# EAGLE design radar (EAGLE 7.6.0)
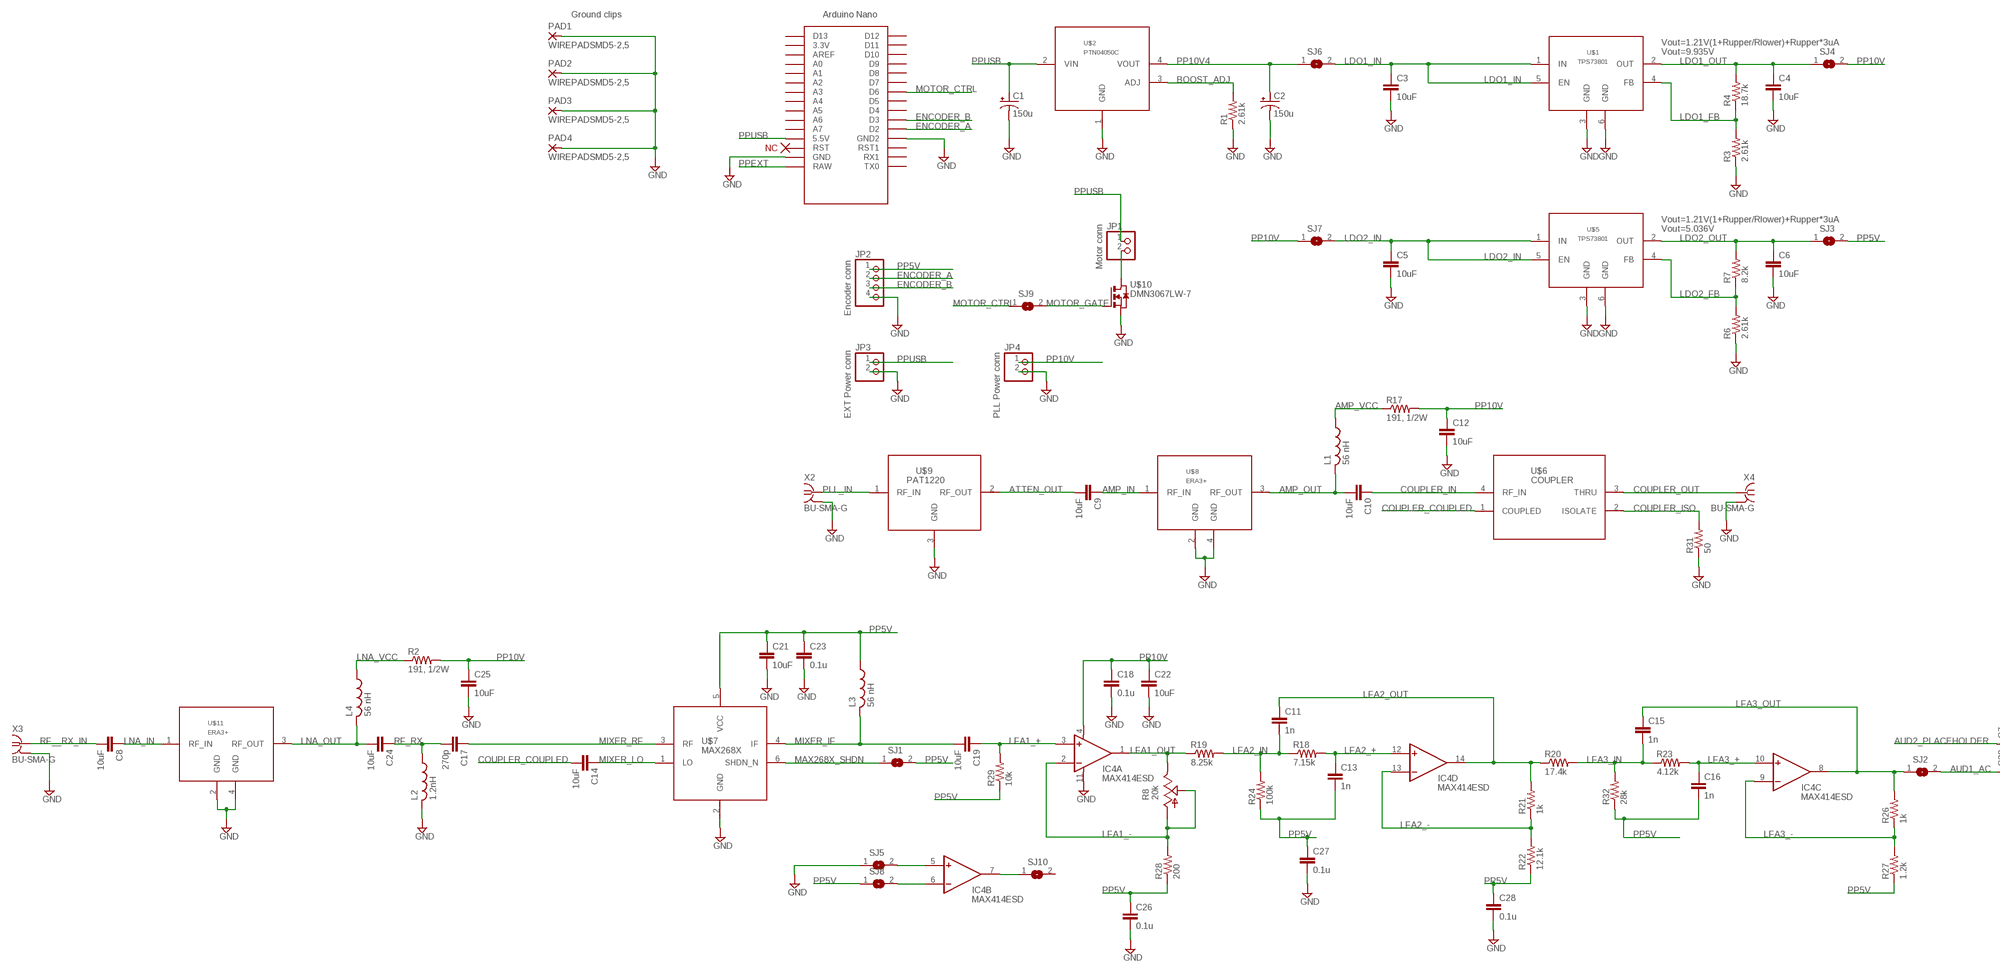
[diagram p0: schematic, sheet 1, part 1 of 2]
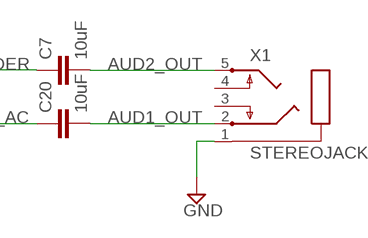
[diagram p1: schematic, sheet 1, part 2 of 2]

## Parts
C1  150u  CPOL-US153CLV-0605  [153CLV-0605]
C2  150u  CPOL-US153CLV-0605  [153CLV-0605]
C3  10uF  C-EUC0805K  [C0805K]
C4  10uF  C-EUC0805K  [C0805K]
C5  10uF  C-EUC0805K  [C0805K]
C6  10uF  C-EUC0805K  [C0805K]
C7  10uF  C-EUC0805K  [C0805K]
C8  10uF  C-EUC0805K  [C0805K]
C9  10uF  C-EUC0805K  [C0805K]
C10  10uF  C-EUC0805K  [C0805K]
C11  1n  C-EUC0603  [C0603]
C12  10uF  C-EUC0805K  [C0805K]
C13  1n  C-EUC0603  [C0603]
C14  10uF  C-EUC0805K  [C0805K]
C15  1n  C-EUC0603  [C0603]
C16  1n  C-EUC0603  [C0603]
C17  270p  C-EUC0603K  [C0603K]
C18  0.1u  C-EUC0603  [C0603]
C19  10uF  C-EUC0805K  [C0805K]
C20  10uF  C-EUC0805K  [C0805K]
C21  10uF  C-EUC0805K  [C0805K]
C22  10uF  C-EUC0805K  [C0805K]
C23  0.1u  C-EUC0603  [C0603]
C24  10uF  C-EUC0805K  [C0805K]
C25  10uF  C-EUC0805K  [C0805K]
C26  0.1u  C-EUC0603  [C0603]
C27  0.1u  C-EUC0603  [C0603]
C28  0.1u  C-EUC0603  [C0603]
IC4  MAX414ESD  [SO14]
JP1  PINHD-1X2  [1X02]
JP2  PINHD-1X4  [1X04]
JP3  PINHD-1X2  [1X02]
JP4  PINHD-1X2  [1X02]
L1  56 nH  L0603  [0603]
L2  1.2nH  L0603  [0603]
L3  56 nH  L0603  [0603]
L4  56 nH  L0603  [0603]
PAD1  WIREPADSMD5-2,5  [5-2,5]
PAD2  WIREPADSMD5-2,5  [5-2,5]
PAD3  WIREPADSMD5-2,5  [5-2,5]
PAD4  WIREPADSMD5-2,5  [5-2,5]
R1  2.61k  R-US_R0603  [R0603]
R2  191, 1/2W  R-US_R1210  [R1210]
R3  2.61k  R-US_R0603  [R0603]
R4  18.7k  R-US_R0603  [R0603]
R6  2.61k  R-US_R0603  [R0603]
R7  8.2k  R-US_R0603  [R0603]
R8  20k  TRIM_US-B25P  [B25P]
R17  191, 1/2W  R-US_R1210  [R1210]
R18  7.15k  R-US_R0603  [R0603]
R19  8.25k  R-US_R0603  [R0603]
R20  17.4k  R-US_R0603  [R0603]
R21  1k  R-US_R0603  [R0603]
R22  12.1k  R-US_R0603  [R0603]
R23  4.12k  R-US_R0603  [R0603]
R24  100k  R-US_R0603  [R0603]
R26  1k  R-US_R0603  [R0603]
R27  1.2k  R-US_R0603  [R0603]
R28  200  R-US_R0603  [R0603]
R29  10k  R-US_R0603  [R0603]
R31  50  R-US_R0603  [R0603]
R32  28k  R-US_R0603  [R0603]
SJ1  SJ  [SJ]
SJ2  SJ  [SJ]
SJ3  SJ  [SJ]
SJ4  SJ  [SJ]
SJ5  SJ  [SJ]
SJ6  SJ  [SJ]
SJ7  SJ  [SJ]
SJ8  SJ  [SJ]
SJ9  SJ  [SJ]
SJ10  SJ  [SJ]
U$1  TPS73801  [SOT223-6]
U$2  PTN04050C  [PTN04050C]
U$3  NANO  [NANO]
U$5  TPS73801  [SOT223-6]
U$6  COUPLER  [COUPLER]
U$7  MAX268X  [SOT23-6]
U$8  ERA3+  [ERA3+]
U$9  PAT1220  [PAT1220]
U$10  DMN3067LW-7  [SOT323]
U$11  ERA3+  [ERA3+]
X1  STEREOJACK  [STX3100]
X2  BU-SMA-G  [BU-SMA-G]
X3  BU-SMA-G  [BU-SMA-G]
X4  BU-SMA-G  [BU-SMA-G]

## Nets
AMP_IN: C9.1 U$8.1(RF_IN)
AMP_OUT: C10.2 L1.2 U$8.3(RF_OUT)
AMP_VCC: L1.1 R17.1
ATTEN_OUT: C9.2 U$9.2(RF_OUT)
AUD1_AC: C20.1 SJ2.2
AUD1_OUT: C20.2 X1.2
AUD2_OUT: C7.2 X1.5
AUD2_PLACEHOLDER: C7.1
BOOST_ADJ: R1.2 U$2.3(ADJ)
COUPLER_COUPLED: C14.2 U$6.1(COUPLED)
COUPLER_IN: C10.1 U$6.4(RF_IN)
COUPLER_ISO: R31.2 U$6.2(ISOLATE)
COUPLER_OUT: U$6.3(THRU) X4.1
ENCODER_A: JP2.2 U$3.D2
ENCODER_B: JP2.3 U$3.D3
GND: C1.- C2.- C3.2 C4.2 C5.2 C6.2 C12.2 C18.2 C21.2 C22.2 C23.2 C25.2 C26.2 C27.2 C28.2 IC4.11(A:V-) JP2.4 JP3.2 JP4.2 L2.2 PAD1.1(P) PAD2.1(P) PAD3.1(P) PAD4.1(P) R1.1 R3.1 R6.1 R31.1 SJ5.1 U$1.3(GND) U$1.6(GND) U$2.1(GND) U$3.GND U$3.GND1(GND2) U$5.3(GND) U$5.6(GND) U$7.2(GND) U$8.2(GND) U$8.4(GND) U$9.3(GND) U$10.2(S) U$11.2(GND) U$11.4(GND) X1.1 X2.2 X2.3 X2.4 X2.5 X3.2 X3.3 X3.4 X3.5 X4.2 X4.3 X4.4 X4.5
LDO1_FB: R3.2 R4.1 U$1.4(FB)
LDO1_IN: C3.1 SJ6.2 U$1.1(IN) U$1.5(EN)
LDO1_OUT: C4.1 R4.2 SJ4.1 U$1.2(OUT)
LDO2_FB: R6.2 R7.1 U$5.4(FB)
LDO2_IN: C5.1 SJ7.2 U$5.1(IN) U$5.5(EN)
LDO2_OUT: C6.1 R7.2 SJ3.1 U$5.2(OUT)
LFA1_+: C19.1 IC4.3(A:+IN) R29.2
LFA1_-: IC4.2(A:-IN) R8.A R8.S R28.2
LFA1_OUT: IC4.1(A:OUT) R8.E R19.1
LFA2_+: C13.1 IC4.12(D:+IN) R18.2
LFA2_-: IC4.13(D:-IN) R21.1 R22.2
LFA2_IN: C11.2 R18.1 R19.2 R24.2
LFA2_OUT: C11.1 IC4.14(D:OUT) R20.1 R21.2
LFA3_+: C16.1 IC4.10(C:+IN) R23.2
LFA3_-: IC4.9(C:-IN) R26.1 R27.2
LFA3_IN: C15.2 R20.2 R23.1 R32.2
LFA3_OUT: C15.1 IC4.8(C:OUT) R26.2 SJ2.1
LNA_IN: C8.1 U$11.1(RF_IN)
LNA_OUT: C24.2 L4.2 U$11.3(RF_OUT)
LNA_VCC: L4.1 R2.1
MAX268X_SHDN: SJ1.1 U$7.6(SHDN_N)
MIXER_IF: C19.2 L3.2 U$7.4(IF)
MIXER_LO: C14.1 U$7.1(LO)
MIXER_RF: C17.1 U$7.3(RF)
MOTOR_CTRL: SJ9.1 U$3.D6
MOTOR_GATE: SJ9.2 U$10.1(G)
N$1: JP1.2 U$10.3(D)
N$2: IC4.7(B:OUT) SJ10.1
N$4: IC4.5(B:+IN) SJ5.2
N$5: IC4.6(B:-IN) SJ8.2
PLL_IN: U$9.1(RF_IN) X2.1
PP5V: C13.2 C16.2 C21.1 C23.1 C26.1 C27.1 C28.1 JP2.1 L3.1 R22.1 R24.1 R27.1 R28.1 R29.1 R32.1 SJ1.2 SJ3.2 SJ8.1 U$7.5(VCC)
PP10V: C12.1 C18.1 C22.1 C25.1 IC4.4(A:V+) JP4.1 R2.2 R17.2 SJ4.2 SJ7.1
PP10V4: C2.+ SJ6.1 U$2.4(VOUT)
PPEXT: U$3.RAW
PPUSB: C1.+ JP1.1 JP3.1 U$2.2(VIN) U$3.5V(5.5V)
RF__RX_IN: C8.2 X3.1
RF_RX: C17.2 C24.1 L2.1
Unconnected: SJ10.2 U$3.3.3V U$3.A0 U$3.A1 U$3.A2 U$3.A3 U$3.A4 U$3.A5 U$3.A6 U$3.A7 U$3.AREF U$3.D4 U$3.D5 U$3.D7 U$3.D8 U$3.D9 U$3.D10 U$3.D11 U$3.D12 U$3.D13 U$3.ICSP1 U$3.ICSP2 U$3.ICSP3 U$3.ICSP4 U$3.ICSP5 U$3.ICSP6 U$3.RST U$3.RST1 U$3.RX1 U$3.TX0 X1.3 X1.4

## Notes on the sheet
- Ground clips
- Vout=1.21V(1+Rupper/Rlower)+Rupper*3uA
- Vout=9.935V
- Vout=1.21V(1+Rupper/Rlower)+Rupper*3uA
- Vout=5.036V
- Motor conn
- Encoder conn
- EXT Power conn | PLL Power conn

## Library data of the parts
C1 C2 = rcl:CPOL-US: POLARIZED CAPACITOR, American symbol; DIGI: PCE4443CT-ND
C3-C10 C12 C14 C19-C22 C24 C25 = rcl:C-EU: CAPACITOR, European symbol; DIGI: 587-2985-1-ND
C11 C13 C15 C16 = rcl:C-EU: CAPACITOR, European symbol; DIGI: 311-1085-1-ND
C17 = rcl:C-EU: CAPACITOR, European symbol; DIGI: 399-9054-1-ND
C18 C23 C26-C28 = rcl:C-EU: CAPACITOR, European symbol; DIGI: 311-1088-1-ND
IC4 = radar:MAX414ESD: OP AMP; DIGI: MAX414ESD+-ND
JP1 JP3 JP4 = pinhead:PINHD-1X2: PIN HEADER
JP2 = pinhead:PINHD-1X4: PIN HEADER
L1 L3 L4 = radar:L0603; DIGI: 712-1443-1-ND
L2 = radar:L0603; DIGI: 535-11530-1-ND
PAD1-PAD4 = wirepad:WIREPAD: Wire PAD connect wire on PCB
R1 R3 R6 = rcl:R-US_: RESISTOR, American symbol; DIGI: 311-2520-1-ND
R2 R17 = rcl:R-US_: RESISTOR, American symbol; DIGI: P191AACT-ND
R4 = rcl:R-US_: RESISTOR, American symbol; DIGI: 311-18.7KHRCT-ND
R7 = rcl:R-US_: RESISTOR, American symbol; DIGI: 311-2680-1-ND
R8 = pot:TRIM_US-: POTENTIOMETER; DIGI: 3362P-203LF-ND
R18 = rcl:R-US_: RESISTOR, American symbol; DIGI: 311-7.15KHRCT-ND
R19 = rcl:R-US_: RESISTOR, American symbol; DIGI: RNCP0805FTD8K25CT-ND
R20 = rcl:R-US_: RESISTOR, American symbol; DIGI: 311-17.4KHRCT-ND
R21 R26 = rcl:R-US_: RESISTOR, American symbol; DIGI: 311-1.00KHRCT-ND
R22 = rcl:R-US_: RESISTOR, American symbol; DIGI: 541-12.1KSCT-ND
R23 = rcl:R-US_: RESISTOR, American symbol; DIGI: 311-4.12KHRCT-ND
R24 = rcl:R-US_: RESISTOR, American symbol; DIGI: 541-3247-1-ND
R27 = rcl:R-US_: RESISTOR, American symbol; DIGI: 311-1.20KHRCT-ND
R28 = rcl:R-US_: RESISTOR, American symbol; DIGI: RNCP0805FTD200RCT-ND
R29 = rcl:R-US_: RESISTOR, American symbol; DIGI: 311-10.0KHRCT-ND
R31 = rcl:R-US_: RESISTOR, American symbol; DIGI: RNCP0805FTD49R9CT-ND
R32 = rcl:R-US_: RESISTOR, American symbol; DIGI: 311-28.0KHRCT-ND
SJ1-SJ10 = jumper:SJ: SMD solder JUMPER
U$1 U$5 = radar:TPS73801; DIGI: 296-39489-1-ND
U$2 = radar:PTN04050C; DIGI: 296-20498-ND
U$3 = Arduino-clone:NANO: Arduino Nano
U$6 = radar:COUPLER: HHM2917B1; DIGI: 445-172645-1-ND
U$7 = radar:MAX268X; DIGI: MAX2682EUT+TCT-ND
U$8 U$11 = radar:ERA3+
U$9 = radar:PAT1220; DIGI: PAT123CT-ND
U$10 = radar:DMN3067LW-7; DIGI: DMN3067LW-7DICT-ND
X1 = adafruit:STEREOJACK: MIC/HEADPHONE JACK Stereo jack with two switches. Kycon STX3100, CUI SJ1-3555NG and/or 4UCon 05544; DIGI: CP1-3555NG-ND
X2-X4 = radar:BU-SMA-G: FEMALE SMA CONNECTOR Radiall distributor RS 193-9117; DIGI: ACX2074-ND; OC_FARNELL: unknown; OC_NEWARK: unknown

## Board
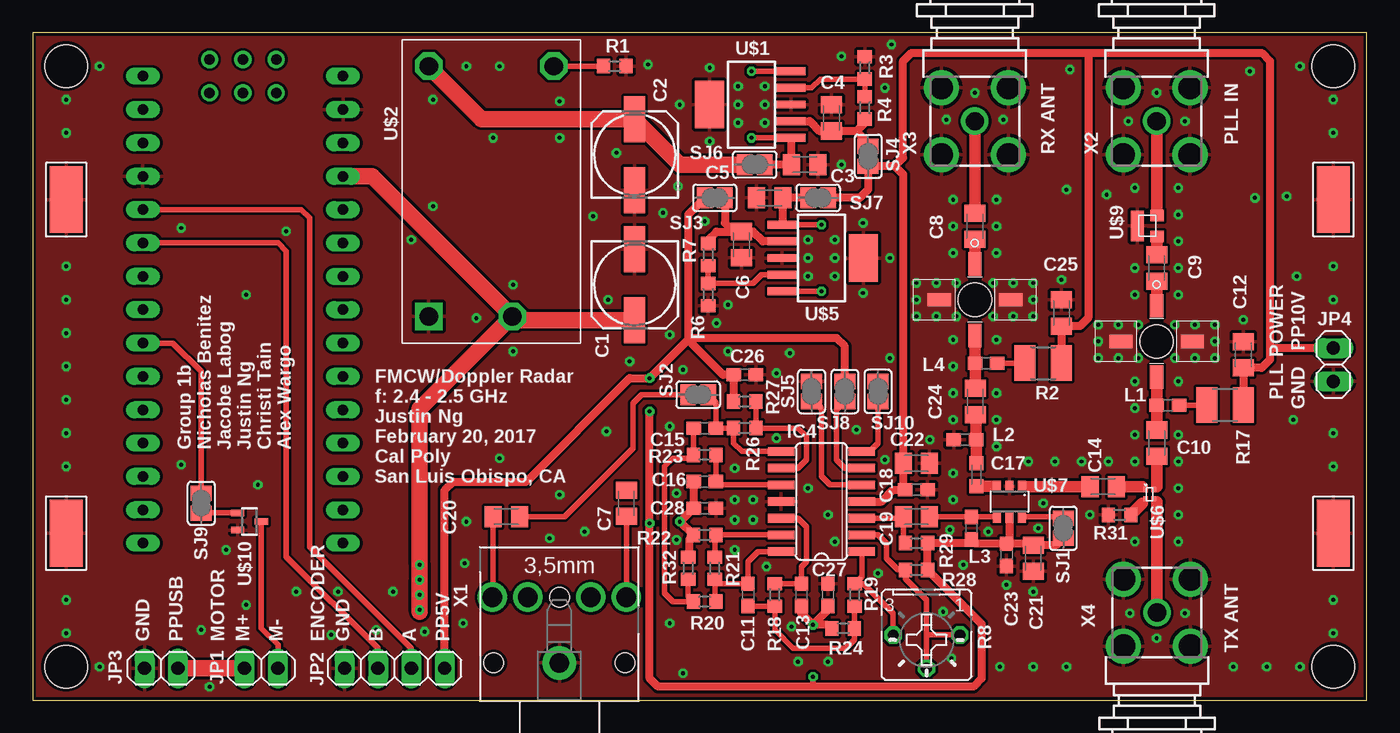
[diagram p2: board, top side]
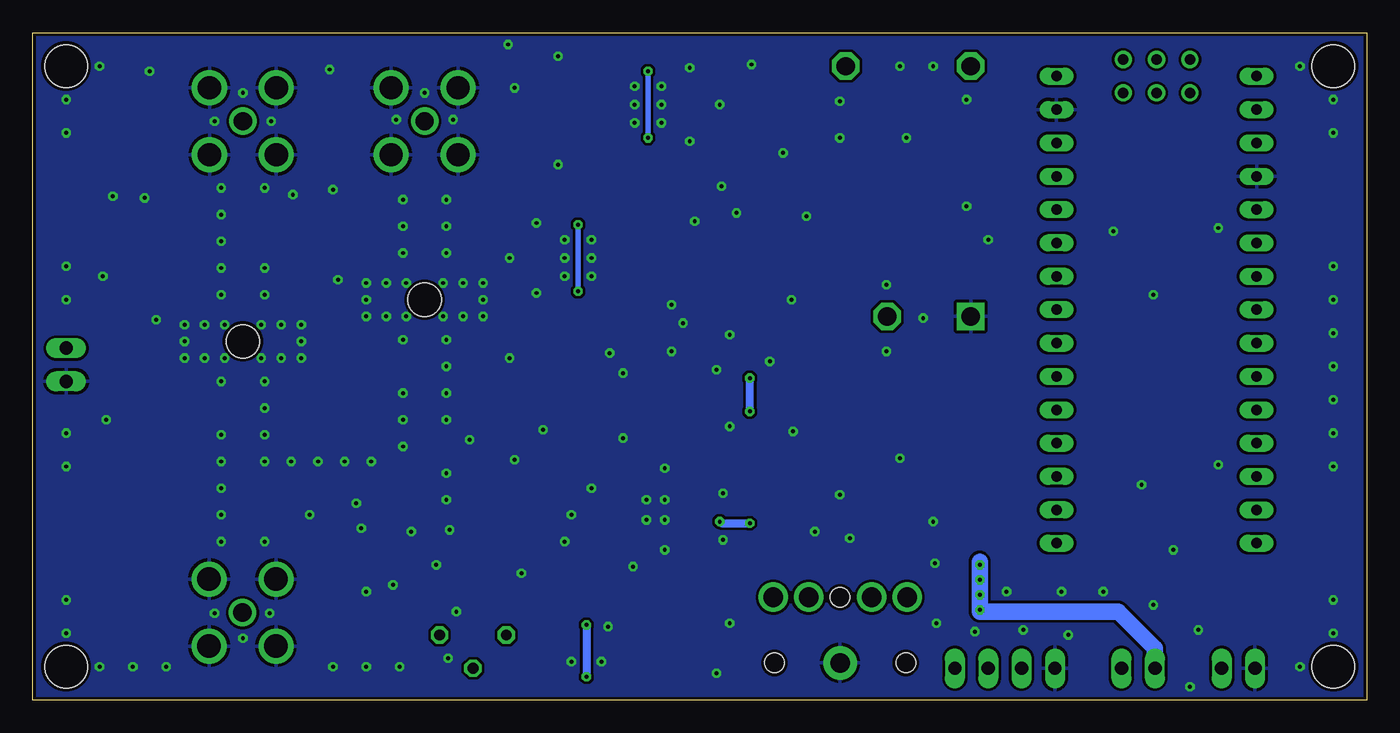
[diagram p3: board, bottom side, seen from below]

Size 101.6 x 50.8 mm. Coordinates in mm from the lower left corner, seen from the top.
Outline: 0,50.8 0,0 101.6,0 101.6,50.8 0,50.8
Copper layers (1*16): Top 0.035mm / dielectric 1.5mm / Bottom 0.035mm
Design rules "default *": minimum track width 8mil, minimum drill 10mil, track to track 8mil, track to pad 8mil, pad to pad 8mil, via to via 8mil, smd to smd 8mil, copper to edge 10mil, drill to drill 8mil, minimum pad ring 10mil, minimum via ring 8mil, stop-mask expansion 4mil, vias tented up to drill 0mil, thermal gap 10mil
Holes 3.26 mm at 2.54,48.26 2.54,2.54 99.06,48.26 99.06,2.54

### Footprints (pad centres in the part's own frame; a part is rotated, then mirrored left to right if it is on the bottom)
153CLV-0605 = smd 3.5 x 1.6: + 2.7,0; - -2.7,0
C0805K = smd 1.3 x 1.6: 1 -1,0; 2 1,0
C0603 = smd 1.1 x 1: 1 -0.85,0; 2 0.85,0
C0603K = smd 1.05 x 1.08: 1 -0.875,0; 2 0.875,0
SO14 = smd 0.66 x 2.032: 1 -3.81,-3.073; 2 -2.54,-3.073; 3 -1.27,-3.073; 4 0,-3.073; 5 1.27,-3.073; 6 2.54,-3.073; 7 3.81,-3.073; 8 3.81,3.073; 9 2.54,3.073; 10 1.27,3.073; 11 0,3.073; 12 -1.27,3.073; 13 -2.54,3.073; 14 -3.81,3.073
1X02 = drill 1.016 long: 1 -1.27,0; 2 1.27,0
1X04 = drill 1.016 long: 1 -3.81,0; 2 -1.27,0; 3 1.27,0; 4 3.81,0
0603 = smd 1.1 x 1: 1 -0.85,0; 2 0.85,0
5-2,5 = smd 2.54 x 5.08: 1 0,0
R0603 = smd 1 x 1.1: 1 -0.85,0; 2 0.85,0
R1210 = smd 1.6 x 2.7: 1 -1.4,0; 2 1.4,0
B25P = drill 0.813 octagon: A -2.54,0; E 2.54,0; S 0,2.54
SJ = smd 1.168 x 1.6: 1 -0.762,0; 2 0.762,0
SOT223-6 = smd 0.6 x 2.2: 1 -2.54,-3; 2 -1.27,-3; 3 0,-3; 4 1.27,-3; 5 2.54,-3 | smd 3.6 x 2.2: 6 0,3.2
PTN04050C = drill 1.397 square: 1 -9.525,4.763 | drill 1.397 octagon: 2 -9.525,-1.587; 3 9.525,-4.763; 4 9.525,4.763
NANO = drill 0.8 long: 3.3V -10.16,24.13; 5V -10.16,-1.27; A0 -10.16,19.05; A1 -10.16,16.51; A2 -10.16,13.97; A3 -10.16,11.43; A4 -10.16,8.89; A5 -10.16,6.35; A6 -10.16,3.81; A7 -10.16,1.27; AREF -10.16,21.59; D2 5.08,1.27; D3 5.08,3.81; D4 5.08,6.35; D5 5.08,8.89; D6 5.08,11.43; D7 5.08,13.97; D8 5.08,16.51; D9 5.08,19.05; D10 5.08,21.59; D11 5.08,24.13; D12 5.08,26.67; D13 -10.16,26.67; GND -10.16,-6.35; GND1 5.08,-1.27; RAW -10.16,-8.89; RST -10.16,-3.81; RST1 5.08,-3.81; RX1 5.08,-6.35; TX0 5.08,-8.89 | drill 0.8: ICSP1 -5.08,-10.16; ICSP2 -5.08,-7.62; ICSP3 -2.54,-10.16; ICSP4 -2.54,-7.62; ICSP5 0,-10.16; ICSP6 0,-7.62
COUPLER = smd 0.4 x 0.35: 1 -0.35,-0.3; 2 0.35,-0.3; 3 0.35,0.3; 4 -0.35,0.3
SOT23-6 = smd 0.6 x 0.9: 1 -0.95,-1.15; 2 0,-1.15; 3 0.95,-1.15; 4 0.95,1.15; 5 0,1.15; 6 -0.95,1.15
ERA3+ = smd 1.016 x 1.778: 1 0,-2.718; 3 0,2.718 | smd 1.778 x 1.016: 2 2.718,0; 4 -2.718,0 | hole 2.54: 0,0
PAT1220 = smd 0.9 x 1: 1 -0.8,1; 2 0.8,1 | smd 2.3 x 1: 3 0,-0.49
SOT323 = smd 0.5 x 1: 1 -0.65,-0.9; 2 0.65,-0.9; 3 0,0.9
STX3100 = drill 1.5 pad 2.54: 1 2.7,-0.1 | drill 1.5: 2 7.7,5; 3 7.7,2.3; 4 7.7,-2.5; 5 7.7,-5.2 | hole 1.5: 2.7,4.9; 2.7,-5.1; 7.7,-0.1
BU-SMA-G = drill 1.397: 1 0,0 | drill 1.778: 2 -2.55,2.55; 3 2.55,2.55; 4 2.55,-2.55; 5 -2.55,-2.55

### Placement (x,y rotation side)
C1  45.85,31.62 270 top
C2  45.85,41.53 90 top
C3  58.8,40.77 0 top
C4  60.83,44.32 90 top
C5  56.13,38.23 180 top
C6  53.98,34.67 270 top
C7  45.21,14.99 270 top
C8  71.75,36.07 90 top
C9  85.6,32.89 90 top
C10  85.62,19.56 90 top
C11  54.48,8 270 top
C12  92.2,26.29 90 top
C13  58.55,8 270 top
C14  81.53,16.26 0 top
C15  51.18,20.7 180 top
C16  51.18,16.64 180 top
C17  71.88,17.14 90 top
C18  67.31,16 0 top
C19  67.31,13.97 0 top
C20  36.07,13.97 180 top
C21  76.2,10.79 270 top
C22  67.31,18.03 0 top
C23  74.17,11.05 270 top
C24  71.78,22.73 90 top
C25  78.36,29.46 90 top
C26  54.23,24.77 0 top
C27  60.58,8 90 top
C28  51.18,14.61 0 top
IC4  60.07,15.11 90 top
JP1  17.4,2.41 0 top
JP2  27.56,2.41 180 top
JP3  9.78,2.41 180 top
JP4  99.06,25.53 270 top
L1  86.46,22.45 180 top
L2  70.99,19.81 180 top
L3  71.5,13.08 90 top
L4  72.62,25.65 180 top
PAD1  99.06,12.7 0 top
PAD2  99.06,38.1 0 top
PAD3  2.54,12.7 0 top
PAD4  2.54,38.1 0 top
R1  44.32,48.26 180 top
R2  76.96,25.65 0 top
R3  63.37,48.13 270 top
R4  63.37,45.09 270 top
R6  51.44,30.86 90 top
R7  51.44,33.91 90 top
R8  68.07,4.95 180 top
R17  90.81,22.48 0 top
R18  56.52,8 90 top
R19  62.61,8 270 top
R20  51.18,7.49 180 top
R21  51.94,10.03 270 top
R22  51.18,12.57 0 top
R23  51.18,18.67 0 top
R24  61.72,5.46 0 top
R26  54.23,20.7 180 top
R27  54.23,22.73 0 top
R28  67.31,9.91 180 top
R29  67.31,11.94 180 top
R31  82.78,14.1 0 top
R32  49.91,10.03 270 top
SJ1  78.49,13.08 270 top
SJ2  50.67,23.24 180 top
SJ3  51.94,38.23 180 top
SJ4  63.63,41.4 270 top
SJ5  59.31,23.5 270 top
SJ6  54.99,40.77 0 top
SJ7  59.82,38.23 180 top
SJ8  61.85,23.5 270 top
SJ9  12.83,14.99 270 top
SJ10  64.39,23.5 90 top
U$1  54.74,45.34 90 top
U$2  34.92,38.73 90 top
U$3  13.46,38.61 180 top
U$5  60.07,33.66 270 top
U$6  85.06,15.67 270 top
U$7  74.4,15.11 180 top
U$8  85.6,27.3 180 top
U$9  84.63,36.09 270 top
U$10  16.51,13.59 270 top
U$11  71.75,30.48 180 top
X1  40.01,0.13 90 top
X2  85.6,44.07 90 top
X3  71.75,44.07 90 top
X4  85.62,6.65 270 top

### Tracks (layer width: path | path; a pad name or v marks a point on that pad's centre or on a via)
AMP_IN
  Top 0.872: C9.1 U$8.1
AMP_OUT
  Top 0.872: U$8.3 85.61,24.57 L1.2 85.62,22.44 C10.2
AMP_VCC
  Top 0.406: R17.1 89.38,22.45 L1.1
ATTEN_OUT
  Top 0.406: 85.6,35.31 85.56,35.34 | U$9.2 85.6,35.26 85.6,35.18
  Top 0.872: C9.2 85.6,35.18 85.6,35.31
AUD1_AC
  Top 0.406: SJ2.2 46.35,23.24 45.72,22.61 45.72,19.18 40.51,13.97 C20.1
AUD1_OUT
  Top 0.406: X1.2 35.07,7.89 C20.2
AUD2_OUT
  Top 0.406: C7.2 45.2,13.98 X1.5
BOOST_ADJ
  Top 0.406: 39.66,48.28 U$2.3 R1.2
COUPLER_COUPLED
  Top 0.305: 84.51,16.26 84.74,16.02 U$6.1
  Top 0.872: C14.2 84.51,16.26
COUPLER_IN
  Top 0.305: 85.62,16.26 85.39,16.02 U$6.4
  Top 0.872: C10.1 85.62,16.26
COUPLER_ISO
  Top 0.305: U$6.2 84.46,15.02 84.46,14.98 84.49,14.96
  Top 0.872: R31.2 84.49,14.96 84.51,14.98
COUPLER_OUT
  Top 0.305: 85.62,15.09 85.6,15.09 U$6.3
  Top 0.872: X4.1 85.62,15.09
ENCODER_A
  Top 0.406: U$3.D2 20.45,37.34 21.08,36.7 21.08,11.68 28.83,3.94 JP2.2
ENCODER_B
  Top 0.406: U$3.D3 18.67,34.8 19.3,34.16 19.3,10.92 26.29,3.94 JP2.3
GND  (via drill 0.3)
  other vias: 72.77,12.83 76.58,13.08 2.54,45.72 2.54,43.18 2.54,33.02 2.54,30.48 2.54,27.94 2.54,25.4 2.54,22.86 2.54,20.32 2.54,17.78 2.54,7.62 2.54,5.08 5.08,2.54 99.06,45.72 99.06,43.18 99.06,33.02 99.06,30.48 99.06,20.32 99.06,17.78 99.06,7.62 99.06,5.08 96.52,2.54 93.98,2.54 91.44,2.54 78.74,2.54 76.2,2.54 73.66,2.54 96.52,48.26 5.08,48.26 33.02,48.26 35.56,48.26 67.31,30.48 76.2,30.48 67.31,31.75 68.83,31.75 67.31,29.21 70.36,31.75 70.36,29.21 68.83,29.21 73.15,31.75 73.15,29.21 76.2,31.75 76.2,29.21 74.68,29.21 74.68,31.75 84.2,28.57 84.2,26.04 87,28.57 87,26.04 81.15,28.57 82.68,28.57 81.15,26.04 81.15,27.3 82.68,26.04 90.04,28.57 90.04,26.04 90.04,27.3 88.52,26.04 88.52,28.57 73.41,36.07 70.1,36.07 70.1,34.04 73.41,34.04 70.1,38.1 73.41,38.1 83.95,32.89 87.25,32.89 83.95,30.86 87.25,30.86 87.25,34.92 87.25,36.96 87.25,38.99 83.95,38.99 70.1,27.43 73.41,27.43 87.25,24.26 83.95,24.26 70.1,25.4 83.95,22.23 70.1,23.37 70.1,21.34 83.95,20.19 83.95,18.16 87.25,20.19 87.25,18.16 73.41,23.37 73.41,21.34 73.41,19.3 87.25,16.13 87.25,14.1 87.25,12.06 83.95,12.06 70.1,17.27 70.1,15.24 81.92,18.16 79.88,18.16 77.85,18.16 75.82,18.16 69.6,44.2 73.91,44.2 83.44,44.07 87.76,44.07 71.75,46.23 85.6,46.23 74.17,8.76 76.2,8.26 80.52,14.1 92.2,28.96 78.36,32 68.33,19.81 61.59,40.77 49.15,39.12 51.56,42.55 51.56,48.13 49.28,45.34 65.28,33.66 63.25,36.32 63.25,30.99 55.75,45.34 53.72,45.34 53.72,46.74 55.75,46.74 53.72,43.94 55.75,43.94 59.05,33.66 61.09,33.66 61.09,35.05 61.09,32.26 59.05,32.26 59.05,35.05 51.18,36.45 52.96,30.1 61.59,49.02 56.64,24.89 53.47,15.24 54.86,15.24 53.47,13.72 54.86,13.72 53.47,11.43 53.47,17.65 59.05,16.13 60.58,14.1 61.09,12.06 55.88,10.16 64.39,9.65 57.78,5.59 58.29,2.92 60.58,2.92 69.98,3.17 69.34,6.73 69.85,12.95 76.96,14.99 70.87,10.29 57.66,26.42 52.96,26.54 62.74,20.57 65.28,26.04 49.53,25.15 48.51,20.83 43.69,20.45 40.13,15.62 42.04,12.83 33.02,13.59 39.37,12.32 32.89,10.41 32.77,5.84 48.51,5.84 49.53,2.03 49.02,15.75 49.02,12.19 45.47,25.78 52.07,28.7 48.51,27.81 33.78,29.08 36.58,31.62 36.58,26.54 30.48,45.72 40.13,45.59 40.13,42.8 46.86,48.39 64.9,46.61 44.45,41.66 48.01,37.08 42.67,36.83 35.56,18.41 27.43,8.26 23.24,8.26 26.16,5.33 29.84,5.21 22.73,4.95 20.07,8.26 16.26,7.24 13.46,1.02 12.83,5.33 17.14,16.38 14.73,11.43 11.3,17.91 11.3,35.94 19.3,35.69 16.26,30.86 30.48,37.59 28.83,35.05 35.05,42.8 43.81,30.48 65.41,49.91 78.99,48.01 92.71,47.88 93.09,38.23 78.74,38.86 95.5,38.35 81.79,38.48 96.01,21.34 96.27,32.26 85.6,4.7 83.57,6.6 87.76,6.6 64.9,18.29 56.64,19.94
  pour Top (rank 6): 101.6,50.8 0,50.8 0,0 101.6,0
  pour Bottom (rank 6): 101.6,0 0,0 0,50.8 101.6,50.8
  pour Top (no thermals): 67.06,32 67.06,28.96 76.45,28.96 76.45,32
  pour Top (no thermals): 80.9,28.83 80.9,25.78 90.3,25.78 90.3,28.83
LDO1_FB
  Top 0.406: R4.1 R3.2 59.98,47.28 59.31,46.61 U$1.4
LDO1_IN  (via drill 0.3)
  Top 0.406: U$1.5 v54.74,47.88 | v54.74,42.8 U$1.1 | 57.74,40.83 C3.1
  Top 0.61: U$1.1 57.74,40.83 | C3.1 SJ6.2
  Bottom 0.406: v54.74,47.88 v54.74,42.8
LDO1_OUT
  Top 0.406: R4.2 63.37,43.96 | 60.98,43.31 60.83,43.31 C4.1 | 63.63,42.43 SJ4.1
  Top 0.61: U$1.2 59.18,44.07 59.93,43.32 C4.1 62.74,43.32 | 63.37,43.96 62.74,43.32 | 62.74,43.32 63.63,42.43
LDO2_FB
  Top 0.406: U$5.4 55.5,32.38 54.86,31.75 51.44,31.75 | 51.44,31.75 R6.2 | 51.44,33.02 R7.1 51.44,31.75
LDO2_IN  (via drill 0.3)
  Top 0.406: v60.07,36.2 U$5.1 57.13,36.26 | v60.07,31.11 U$5.5
  Top 0.61: 57.13,36.26 C5.1 SJ7.2
  Bottom 0.406: v60.07,36.2 v60.07,31.11
LDO2_OUT
  Top 0.406: 54.86,35.67 C6.1 | R7.2 51.44,35.04
  Top 0.61: U$5.2 55.61,34.92 54.86,35.67 | 51.44,35.04 52.07,35.67 C6.1 53.34,35.67 52.7,36.31 SJ3.1
LFA1_+
  Top 0.406: IC4.3 66.18,13.84 C19.1 66.31,12.34 66.46,12.19 R29.2
LFA1_-
  Top 0.406: IC4.2 64.39,12.57 65.02,11.94 65.02,10.79 65.91,9.91 R28.2 | 66.46,10.25 R28.2 | 68.07,4.95 R8.A | R8.S 68.07,4.95 | R28.2 66.46,9.23 68.07,7.62 68.07,4.95
LFA1_OUT
  Top 0.406: 63.14,9.5 IC4.1 63.14,9.38 R19.1 63.28,8.85 65.53,6.6 R8.E
LFA2_+
  Top 0.406: IC4.12 58.29,13.84 58.93,13.21 58.93,10.54 58.55,10.16 C13.1 R18.2
LFA2_-
  Top 0.406: IC4.13 R22.2 51.94,12.48 R21.1
LFA2_IN
  Top 0.406: C11.2 R18.1 56.52,5.33 57.91,3.94 61.94,3.94 62.57,4.57 R24.2 62.57,7.11 R19.2
LFA2_OUT
  Top 0.406: R20.1 51.94,7.58 R21.2 52.27,8.85 C11.1 54.48,10.54 55.24,11.3 IC4.14
LFA3_+
  Top 0.406: 52.07,16.38 IC4.10 | 52.03,16.34 52.07,16.38 | R23.2 C16.1 52.07,16.6 52.07,16.38
LFA3_-
  Top 0.406: IC4.9 58.29,17.65 58.93,18.29 58.93,20.07 58.29,20.7 R26.1 R27.2
LFA3_IN
  Top 0.406: C15.2 R23.1 50.33,18.29 50.2,18.41 48.77,18.41 48.13,17.78 48.13,8.13 48.77,7.49 R20.2 49.91,7.91 R32.2
LFA3_OUT
  Top 0.406: IC4.8 54.01,18.92 53.38,19.56 R26.2 C15.1 52.03,22.64 SJ2.1
LNA_IN
  Top 0.872: C8.1 U$11.1
LNA_OUT
  Top 0.872: U$11.3 71.77,27.75 L4.2 C24.2
LNA_VCC
  Top 0.406: R2.1 L4.1
MAX268X_SHDN
  Top 0.406: U$7.6 78.37,13.96 SJ1.1
MIXER_IF
  Top 0.406: U$7.4 71.53,13.96 L3.2 71.46,13.97 C19.2
MIXER_LO
  Top 0.406: 75.49,16.26 U$7.1
  Top 0.872: C14.1 75.49,16.26
MIXER_RF
  Top 0.406: 73.29,16.27 U$7.3
  Top 0.872: C17.1 73.29,16.27
MOTOR_CTRL
  Top 0.406: U$3.D6 10.67,27.18 12.83,25.02 SJ9.1
MOTOR_GATE
  Top 0.406: 15.6,14.22 U$10.1 12.84,14.24 SJ9.2
N$1
  Top 0.406: U$10.3 17.4,13.58 17.4,5.46 18.67,4.19 JP1.2
N$2
  Top 0.406: SJ10.1 64.39,19.56 63.75,18.92 IC4.7
N$4
  Top 0.406: SJ5.2 arc-90 60.07,21.97 60.07,17.02 60.71,16.38 IC4.5
N$5
  Top 0.406: SJ8.2 61.21,22.1 61.21,18.29 61.85,17.65 IC4.6
PLL_IN
  Top 0.406: 85.6,36.88 85.56,36.84 | U$9.1 85.6,36.93 85.6,36.96
  Top 0.872: X2.1 85.6,36.96 85.6,36.88
PP5V  (via drill 0.3)
  Top 0.406: 74.4,12.13 C23.1 | 71.83,11.9 L3.1 71.21,11.94 | R24.1 60.58,5.75 60.54,5.71 | 49.91,10.96 R32.1 49.99,10.96 | C27.1 60.58,6.86 | v59.44,1.78 59.44,1.02 | 58.55,6.6 C13.2 | 49.31,13.59 v49.28,13.59 | 49.91,27.56 49.91,27.43
  Top 0.61: U$7.5 74.4,12.13 | 71.83,11.9 C23.1 76.1,11.9 C21.1 77.96,11.79 SJ1.2 | 71.21,11.94 R29.1 R28.1 72.26,5.8 72.26,1.65 71.63,1.02 59.44,1.02 47.62,1.02 46.99,1.65 v46.99,13.46 v46.99,21.97 | C16.2 C28.1 49.31,13.59 R22.1 49.99,12.23 49.99,10.96 | R27.1 C26.1 52.58,24.77 49.91,27.43 v46.99,24.51 45.47,24.51 37.59,16.64 32,16.64 31.37,16 JP2.1 | 60.58,6.86 v59.44,5.71 | v59.44,5.71 58.55,6.6 | 60.54,5.71 v59.44,5.71 | SJ3.2 49.91,36.96 49.91,27.56 61.21,27.56 61.85,26.92 SJ8.1
  Bottom 0.406: v49.28,13.59 49.15,13.46
  Bottom 0.61: v59.44,5.71 v59.44,1.78 | 49.15,13.46 v46.99,13.46 | v46.99,21.97 v46.99,24.51
PP10V
  Top 0.406: C18.1 66.31,16.15 | R2.2 | R17.2 | 65.67,40.64 65.72,40.69 65.72,40.7 65.66,40.64 | 94.36,26.8 94.23,26.67
  Top 0.61: IC4.4 64.64,15.11 65.53,16 C18.1 | 66.31,16.15 C22.1 66.31,40.01 65.67,40.64 | 80.39,49.28 80.39,29.1 79.76,28.46 C25.1 R2.2 | 80.39,49.28 66.93,49.28 66.29,48.64 66.29,41.27 65.72,40.7 | 80.39,49.28 93.6,49.28 94.23,48.64 94.23,26.67 94.23,25.92 93.6,25.29 C12.1 R17.2 | SJ7.1 62.99,38.23 63.63,38.86 SJ4.2 65.66,40.64 | JP4.1 94.36,26.8
PP10V4
  Top 1.27: U$2.4 34.19,44.23 C2.+ 49.31,40.77 SJ6.1
PPUSB  (via drill 0.3)
  Top 0.406: 36.8,28.92 U$2.2
  Top 1.27: C1.+ 36.8,28.92 | U$3.5V 25.84,39.88 U$2.2 29.46,22.16 v29.46,10.29 | JP3.1 JP1.1 | 29.46,6.73 v29.46,6.86 | v29.46,6.86 v29.46,8 v29.46,9.14 v29.46,10.29 | v29.46,10.29 v29.46,6.86
  Bottom 1.27: 29.46,10.54 v29.46,6.86 29.46,6.73 18.92,6.73 16.13,3.94 JP1.1
RF__RX_IN
  Top 0.872: X3.1 C8.2
RF_RX
  Top 0.872: C24.1 71.84,21.67 L2.1 71.88,19.77 C17.2

### Text on the board
tPlace: RX ANT | PLL IN | PP10V | GND | PLL POWER | Group 1b / Nicholas Benitez / Jacobe Labog / Justin Ng / Christi Tain / Alex Wargo | FMCW/Doppler Radar / f: 2.4 - 2.5 GHz / Justin Ng / February 20, 2017 / Cal Poly / San Luis Obispo, CA | TX ANT | GND | PPUSB | MOTOR | M+ | M- | ENCODER | GND | B | A | PP5V